# EAGLE schematic detector0 (EAGLE 6.1)
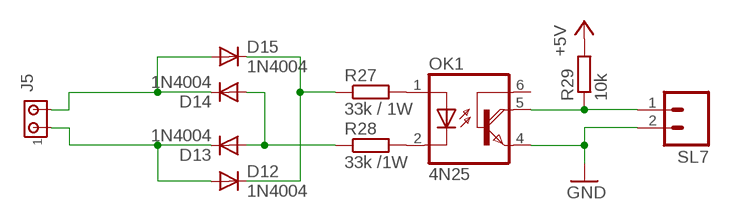
[diagram p0: schematic, sheet 1]

## Parts
D12  1N4004  [DO41-10]
D13  1N4004  [DO41-10]
D14  1N4004  [DO41-10]
D15  1N4004  [DO41-10]
J5  MTA02-156  [1X2MTA]
OK1  4N25  4N33  [DIL06]
R27  33k / 1W  R-EU_0207/15  [0207/15]
R28  33k /1W  R-EU_0207/15  [0207/15]
R29  10k  R-EU_0207/10  [0207/10]
SL7  M02  [02P]

## Nets
+5V: R29.2
GND: OK1.4(E) SL7.2
N$6: D14.C D15.A J5.2
N$38: D13.A D14.A R28.1
N$39: D12.A D13.C J5.1
N$40: D12.C D15.C R27.1
N$41: OK1.1(A) R27.2
N$42: OK1.2(C) R28.2
N$49: OK1.5(COL) R29.1 SL7.1
Unconnected: OK1.6(B)

## Library data of the parts
D12-D15 = diode:1N4004: DIODE general purpose rectifier, 1 A
J5 = con-amp:MTA02-156: AMP connector
OK1 = optocoupler:4N33: MOTOROLA OPTO COUPLER; MF: VISHAY/TELEFUNKEN; MPN: 4N33; OC_FARNELL: 1469601; OC_NEWARK: 88K1390
R27-R29 = resistor:R-EU_: RESISTOR, European symbol
SL7 = con-amp-quick:M02: AMP QUICK CONNECTOR; OC_FARNELL: unknown; OC_NEWARK: unknown